# Altium schematic sheet PowerSupply.SchDoc
size A4; Author: Eyke Liegmann; CompanyName: Technische Universität München; Address1: Arcisstr. 21; Address2: 80333 München; Address3: GERMANY; SheetNumber: 2; SheetTotal: 3; CompanyName2: TU München
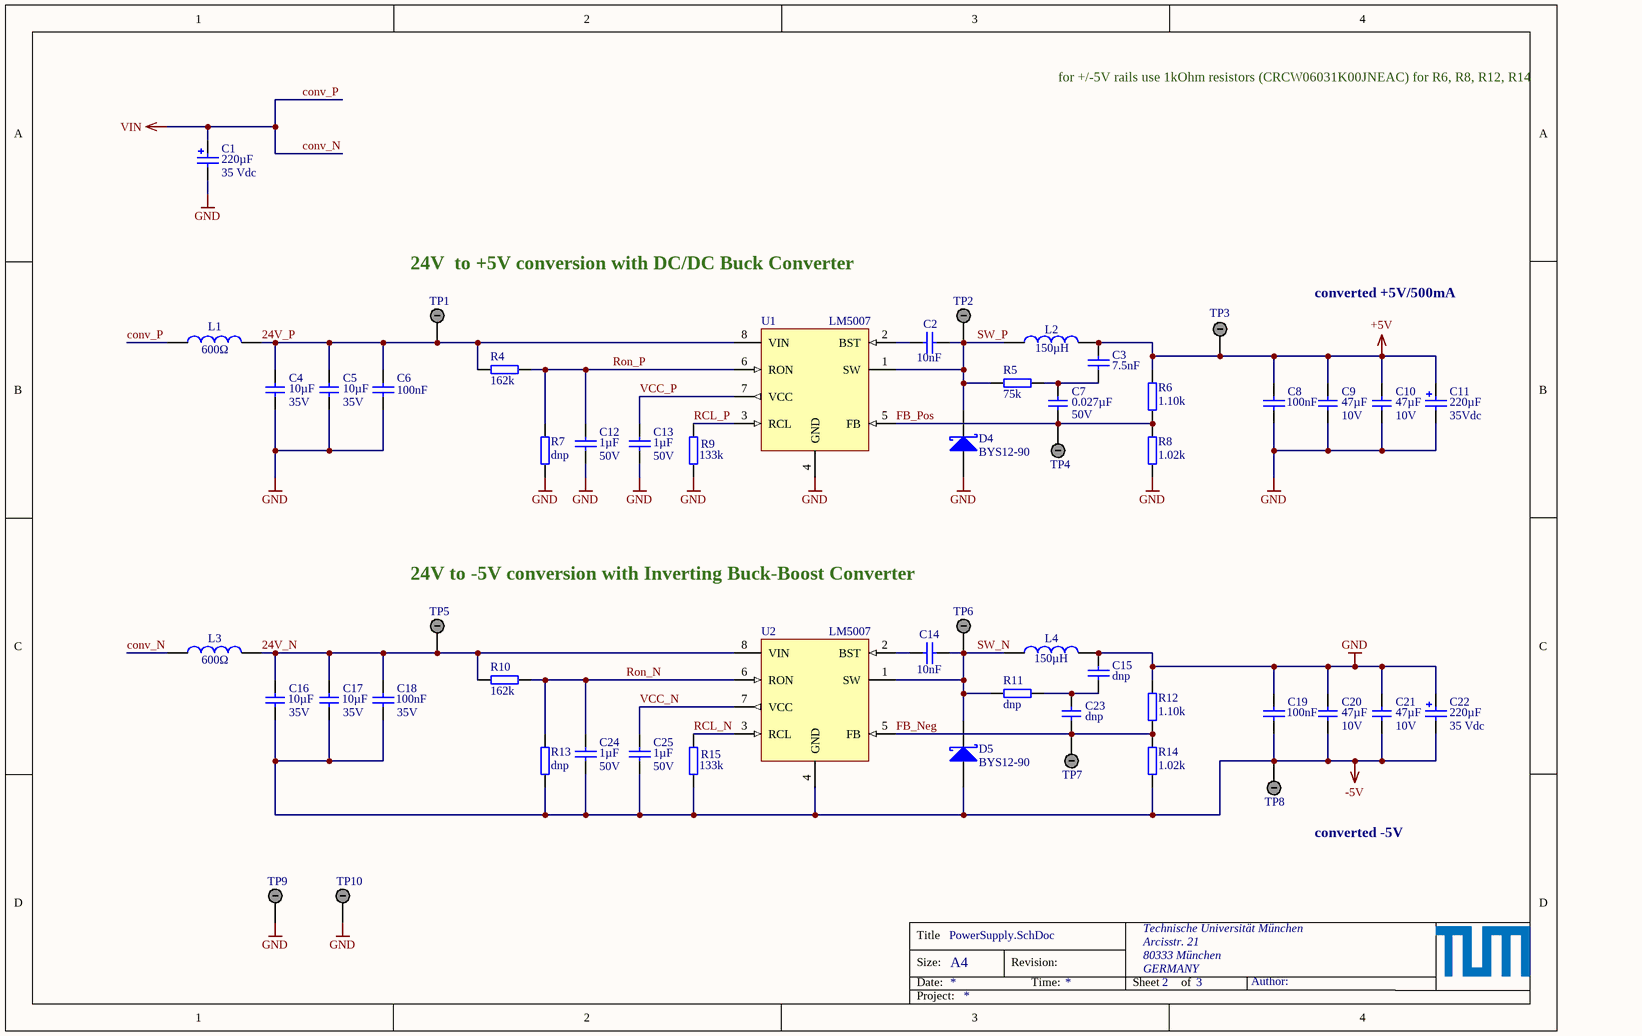
[diagram p0: PowerSupply.SchDoc]

## Parts
C1  220µF  Voltage: 35 Vdc  [WCAP-ATG5_8x11.5x3.5]
C2  10nF  [CAPC1608X07N]
C3  7.5nF  [CAPC1608X07N]
C4  10µF  Voltage: 35V  [C_1206]
C5  10µF  Voltage: 35V  [C_1206]
C6  100nF  [CAPC1608X07N]
C7  0.027µF  Voltage: 50V  [C_1206]
C8  100nF  [CAPC1608X07N]
C9  47µF  Voltage: 10V  [C_1206]
C10  47µF  Voltage: 10V  [C_1206]
C11  220µF  Voltage: 35Vdc  [WCAP-ATG5_8x11.5x3.5]
C12  1µF  Voltage: 50V  [CAPC1608X07N]
C13  1µF  Voltage: 50V  [CAPC1608X07N]
C14  10nF  [CAPC1608X07N]
C15  dnp  [CAPC1608X07N]
C16  10µF  Voltage: 35V  [C_1206]
C17  10µF  Voltage: 35V  [C_1206]
C18  100nF  Voltage: 35V  [CAPC1608X07N]
C19  100nF  [CAPC1608X07N]
C20  47µF  Voltage: 10V  [C_1206]
C21  47µF  Voltage: 10V  [C_1206]
C22  220µF  Voltage: 35 Vdc  [WCAP-ATG5_8x11.5x3.5]
C23  dnp  [C_1206]
C24  1µF  Voltage: 50V  [CAPC1608X07N]
C25  1µF  Voltage: 50V  [CAPC1608X07N]
D4  BYS12-90  [DIOM4227X23N]
D5  BYS12-90  [DIOM4227X23N]
L1  600Ω  [WE-CBF_0805_High Current]
L2  150µH  [SMT_inductor_1050_Performance]
L3  600Ω  [WE-CBF_0805_High Current]
L4  150µH  [SMT_inductor_1050_Performance]
R4  162k  [RESC1608X06N]
R5  75k  [RESC1608X06N]
R6  1.10k  [RESC1608X06N]
R7  dnp  [RESC1608X06N]
R8  1.02k  [RESC1608X06N]
R9  133k  [RESC1608X06N]
R10  162k  [RESC1608X06N]
R11  dnp  [RESC1608X06N]
R12  1.10k  [RESC1608X06N]
R13  dnp  [RESC1608X06N]
R14  1.02k  [RESC1608X06N]
R15  133k  [RESC1608X06N]
TP1  24V_P  [TP_5006]  (value not drawn)
TP2  SW_P  [TP_5006]  (value not drawn)
TP3  +5V  [TP_5006]  (value not drawn)
TP4  FB_P  [TP_5006]  (value not drawn)
TP5  24V_N  [TP_5006]  (value not drawn)
TP6  SW_N  [TP_5006]  (value not drawn)
TP7  FB_N  [TP_5006]  (value not drawn)
TP8  -5V  [TP_5006]  (value not drawn)
TP9  GND  [TP_5006]  (value not drawn)
TP10  GND  [TP_5006]  (value not drawn)
U1  LM5007  [TSOP65P490X110-8N]
U2  LM5007  [TSOP65P490X110-8N]

## Nets
+5V: C3.1 C8.2 C9.2 C10.2 C11.1(P) L2.2 R6.2 TP3.1
-5V: C16.1 C17.1 C18.2 C19.1 C20.1 C21.1 C22.2(N) C24.2 C25.2 D5.2(A) R13.1 R14.2 R15.1 TP8.1 U2.4(GND)
conv_N: C1.1(P) L1.1 L3.1  [also labelled conv_P, VIN]
GND: C1.2(N) C4.1 C5.1 C6.2 C8.1 C9.1 C10.1 C11.2(N) C12.2 C13.2 C15.1 C19.2 C20.2 C21.2 C22.1(P) D4.2(A) L4.2 R7.1 R8.1 R9.1 R12.1 TP9.1 TP10.1 U1.4(GND)
24V_N: C16.2 C17.2 C18.1 L3.2 R10.2 TP5.1 U2.8(VIN)
24V_P: C4.2 C5.2 C6.1 L1.2 R4.1 TP1.1 U1.8(VIN)
FB_Neg: C23.2 R12.2 R14.1 TP7.1 U2.5(FB)
FB_Pos: C7.1 R6.1 R8.2 TP4.1 U1.5(FB)
RCL_N: R15.2 U2.3(RCL)
RCL_P: R9.2 U1.3(RCL)
Ron_N: C24.1 R10.1 R13.2 U2.6(RON)
Ron_P: C12.1 R4.2 R7.2 U1.6(RON)
SW_N: C14.1 D5.1(K) L4.1 R11.2 TP6.1 U2.1(SW)
SW_P: C2.2 D4.1(K) L2.1 R5.1 TP2.1 U1.1(SW)
VCC_N: C25.1 U2.7(VCC)
VCC_P: C13.1 U1.7(VCC)
NetC2_1: C2.1 U1.2(BST)
NetC3_2: C3.2 C7.2 R5.2
NetC14_2: C14.2 U2.2(BST)
NetC15_2: C15.2 C23.1 R11.1

## Notes on the sheet
- for +/-5V rails use 1kOhm resistors (CRCW06031K00JNEAC) for R6, R8, R12, R14
- (near TP1) 24V  to +5V conversion with DC/DC Buck Converter
- converted +5V/500mA
- 24V to -5V conversion with Inverting Buck-Boost Converter
- converted -5V
- Title
- Size:
- Date:
- A4
- Revision:
- Time:
- Sheet
- of
- Author:
- Project:

## Library data of the parts
C1 C11 C22 = 860020574012: WCAP-ATG5 Aluminum Electrolytic Capacitors, 8x11.5mm, 35 Vdc, 220 uF; MF: Würth Elektronik; ComponentLink1Description: Manufacturer; ComponentLink1URL: http://www.we-online.de; ComponentLink2Description: Datasheet; ComponentLink2URL: http://katalog.we-online.com/pbs/datasheet/860020574012.pdf; Part Number: 860020574012; Size: 8x11.5mm; Life Cycle: 2000h; Operating Temperature: -40 °C up to +105 °C; Value: 220 µF; MPN: 860020574012; Supplier 1: Mouser; Supplier Part Number 1: 710-860020574012
C2 C14 = Cap_0603: MPN: 885012206065; MF: Würth Elektronik; Voltage: 25V; Dielectric: X7R; Value: 10nF; Supplier 1: Mouser; Supplier 2: Digi-Key; Supplier Part Number 1: 710-885012206065; Supplier Part Number 2: 732-7983-1-ND; Package: 0603
C3 = Cap_0603: MPN: C0603C752J3GACTU; MF: KEMET; Voltage: 25V; Dielectric: C0G; Tolerance: 5%; Value: 7.5nF; Supplier 1: Mouser; Supplier 2: *; Supplier Part Number 1: 80-C0603C752J3GACTU; Supplier Part Number 2: *; Package: 0603
C4 C5 C16 C17 = C_1206: Capacitor 1206; MPN: GRT31CC8YA106KE01L; Tolerance: 10%; MF: Murata Electronics; Dielectric: X6S; Package: 1206; Value: 10µF; Supplier 1: Mouser; Supplier Part Number 1: 81-GRT31CC8YA106KE1L
C6 = Cap_0603: MPN: 885012206071; MF: Würth Elektronik; Voltage: 25V; Dielectric: X7R; Value: 100nF; Supplier 1: Mouser; Supplier 2: Digi-Key; Supplier Part Number 1: 710-885012206071; Supplier Part Number 2: 732-7989-1-ND; Package: 0603
C7 = C_1206: Capacitor 1206; MPN: GRM3195C1H273JA01D; Tolerance: 5%; MF: Murata Electronics; Dielectric: C0G; Package: 1206; Value: 0.027µF; Supplier 1: Mouser; Supplier Part Number 1: 81-GRM315C1H273JA01D
C8 C19 = Cap_0603: MPN: 885012206071; MF: Würth Elektronik; Voltage: 25V; Dielectric: X7R; Tolerance: 10%; Value: 100nF; Supplier 1: Mouser; Supplier 2: *; Supplier Part Number 1: 710-885012206071; Supplier Part Number 2: *; Package: 0603
C9 C10 C20 C21 = C_1206: Capacitor 1206; MPN: GRM31CR61A476ME15L; Tolerance: 20%; MF: Murata Electronics; Dielectric: X5R; Package: 1206; Value: 47µF; Supplier 1: Mouser; Supplier Part Number 1: 81-GRM31CR61A476ME5L
C12 C13 C24 C25 = Cap_0603: MPN: GRT188R61H105KE13D; MF: Murata Electronics; Dielectric: X5R; Value: 1µF; Supplier 1: Mouser; Supplier 2: Digi-Key; Supplier Part Number 1: 81-GRT188R61H105KE3D; Supplier Part Number 2: 490-12330-1-ND; Package: 0603
C15 = Cap_0603: MPN: C0603C752J3GACTU; possibleValue: 7.5nF; MF: KEMET; Voltage: 25V; Dielectric: C0G; Tolerance: 5%; Supplier 1: Mouser; Supplier 2: *; Supplier Part Number 1: 80-C0603C752J3GACTU; Supplier Part Number 2: *; Package: 0603; Value: dnp
C18 = Cap_0603: MPN: GMK107B7104KAHT; MF: Taiyo Yuden; Tolerance: 10%; Dielectric: X7R; Value: 100nF; Supplier 1: Mouser; Supplier 2: Digi-Key; Supplier Part Number 1: 963-GMK107B7104KAHT; Supplier Part Number 2: 587-3354-1-ND; Package: 0603
C23 = C_1206: Capacitor 1206; MPN: GRM3195C1H273JA01D; possibleValue: 0.027µF; Tolerance: 5%; MF: Murata Electronics; Dielectric: C0G; Voltage: 50V; Package: 1206; Supplier 1: Mouser; Supplier Part Number 1: 81-GRM315C1H273JA01D; Value: dnp
D4 D5 = BYS12-90: Schottky Diode; MPN: BYS12-90-E3/TR3; MF: Vishay; Forward Voltage: 750mV; Reverse Voltage: 90V; Rated Current: 1.5A; Package: DO-214AC; Supplier 1: Farnell; Supplier 2: Mouser; Supplier 3: Digi-Key; Supplier Part Number 1: 2889144; Supplier Part Number 2: 625-BYS12-90-E3/TR3; Supplier Part Number 3: BYS12-90-E3/GICT-ND
L1 L3 = WE-CBF, 742792040: WE-CBF SMD EMI Suppression Ferrite Bead, 0805, 600Ω; MF: Würth Elektronik; Type: High Current; ComponentLink1Description: Manufacturer; ComponentLink1URL: http://www.we-online.de; ComponentLink2Description: Datasheet; ComponentLink2URL: http://katalog.we-online.de/pbs/datasheet/742792040.pdf; MPN: 742792040; Value: 600Ω; Size: 0805; Supplier 1: Farnell; Supplier 2: Mouser; Supplier 3: Digi-Key; Supplier Part Number 2: 710-742792040; Supplier Part Number 3: 732-1620-1-ND
  L1: Supplier Part Number 1: 2761567
  L3: Supplier Part Number 1: 1635735
L2 L4 = B82464G4154M: SMT power Inductor, 150uH, 320m DRC; MF: EPCOS / TDK; Rated Current: 0.85 A; Tolerance: 20%; MPN: B82464G4154M; Supplier 1: Mouser; Supplier Part Number 1: 871-B82464G4154M; Value: 150µH; DCR: 320m
R4 R10 = R_0603: MPN: CR0603-FX-1623ELF; MF: Bourns; Value: 162k; Supplier 1: Mouser; Supplier Part Number 1: 652-CR0603-FX1623ELF; Package: 0603
R5 = R_0603: MPN: AC0603FR-1375KL; MF: Yageo; Value: 75k; Supplier 1: Mouser; Supplier Part Number 1: 603-AC0603FR-1375KL; Package: 0603
R6 R12 = R_0603: MPN: CRCW06031K10JNEAC; MF: Vishay / Dale; Tolerance: 5%; Value: 1.10k; Supplier 1: Mouser; Supplier Part Number 1: 71-CRCW06031K10JNEAC; Package: 0603
R7 R13 = R_0603: Value: dnp; Package: 0603
R8 R14 = R_0603: MPN: CR0603-FX-1021ELF; MF: Bourns; Tolerance: 1%; Value: 1.02k; Supplier 1: Mouser; Supplier Part Number 1: 652-CR0603FX-1021ELF; Package: 0603
R9 R15 = R_0603: MPN: CR0603-FX-1333ELF; MF: Bourns; Value: 133k; Supplier 1: Mouser; Supplier Part Number 1: 652-CR0603FX-1333ELF; Package: 0603
R11 = R_0603: MPN: AC0603FR-1375KL; possibleValue: 75k; MF: Yageo; Supplier 1: Mouser; Supplier Part Number 1: 603-AC0603FR-1375KL; Package: 0603; Value: dnp
TP1-TP10 = 5006: Test Point;  Compact;  THM;  PC;  .350 L;  .125 OD;  Heat Resistant Nylon 46;  Black; Manufacturer: Keystone Electronics; Body Material: PBT; Plating: Silver; Number of Ports: 1; Outside Diameter: 3.18mm; Inside Diameter: 1.78mm; Hole Diameter: 1.6mm; Supplier 1: Mouser; Manufacturer Part Number: 5006; RoHS: Yes; Category: Connectors; Stock 1: 203116; Mount: PCB,Through Hole; Material: Nylon,Bronze,Silver; Contact Material: Bronze; Contact Plating: Tin,Silver; Color: Black; Housing Color: Black; Package Quantity: 100; Packaging: Bulk; Orientation: Straight; Length: 8.89mm; Height: 0.35inch; Lead Free: Lead Free; REACH SVHC: No SVHC; Flammability Rating: UL94 V-0; ComponentLink1URL: https://datasheet.ciiva.com/1123/m60-2p60-1123808.pdf?src-supplier=Newark; ComponentLink1Description: https://datasheet.ciiva.com/1123/m60-2p60-1123808.pdf?src-supplier=Newark; ComponentLink2URL: https://datasheet.ciiva.com/1454/1718283-1454829.pdf?src-supplier=Element14; ComponentLink2Description: https://datasheet.ciiva.com/1454/1718283-1454829.pdf?src-supplier=Element14; ComponentLink3URL: https://datasheet.ciiva.com/11744/0900766b8009b7c7-11744947.pdf?src-supplier=RSComponents; ComponentLink3Description: https://datasheet.ciiva.com/11744/0900766b8009b7c7-11744947.pdf?src-supplier=RSComponents; ComponentLink4URL: https://datasheet.ciiva.com/2917/m60-2p60-2917629.pdf?src-supplier=Digi-Key; ComponentLink4Description: https://datasheet.ciiva.com/2917/m60-2p60-2917629.pdf?src-supplier=Digi-Key; ComponentLink5URL: https://datasheet.ciiva.com/16883/70182825-16883963.pdf?src-supplier=Allied+Electronics; ComponentLink5Description: https://datasheet.ciiva.com/16883/70182825-16883963.pdf?src-supplier=Allied+Electronics; Supplier Part Number 1: 534-5006
U1 U2 = LM5007: Buck Converter, 9-75Vin, 2.5-73Vout; MPN: LM5007MM/NOPB; MF: Texas Instruments; Supplier 1: Farnell; Supplier 2: Mouser; Supplier 3: Digi-Key; Supplier Part Number 1: 3007210; Supplier Part Number 2: 926-LM5007MM/NOPB; Supplier Part Number 3: 296-LM5007MM/NOPBCT-ND; Package: VSSOP-8